# EAGLE schematic ESP32- 3.5 TFT Display(SPI)V1.0_20230116 (EAGLE 9.6.2)
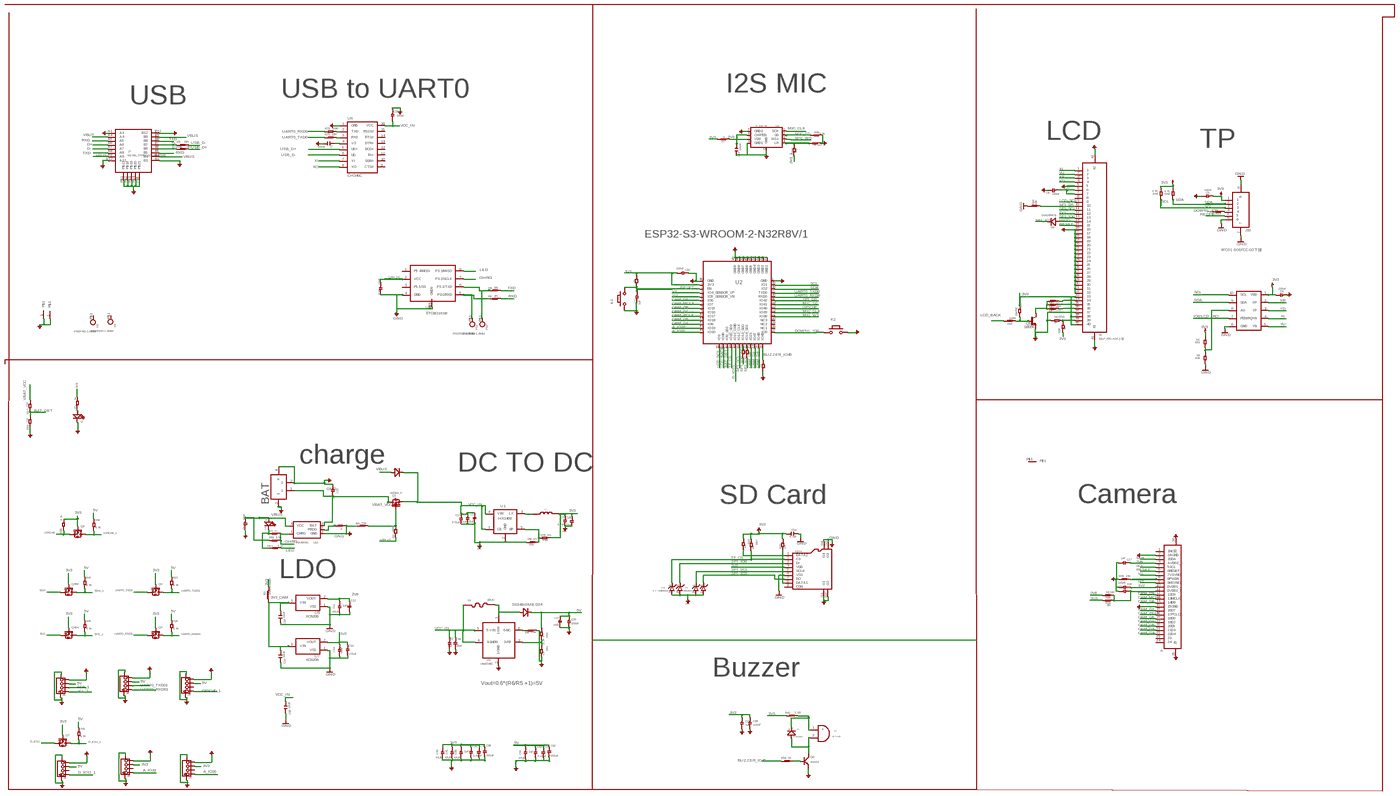
[diagram p0: schematic, sheet 1, overview]
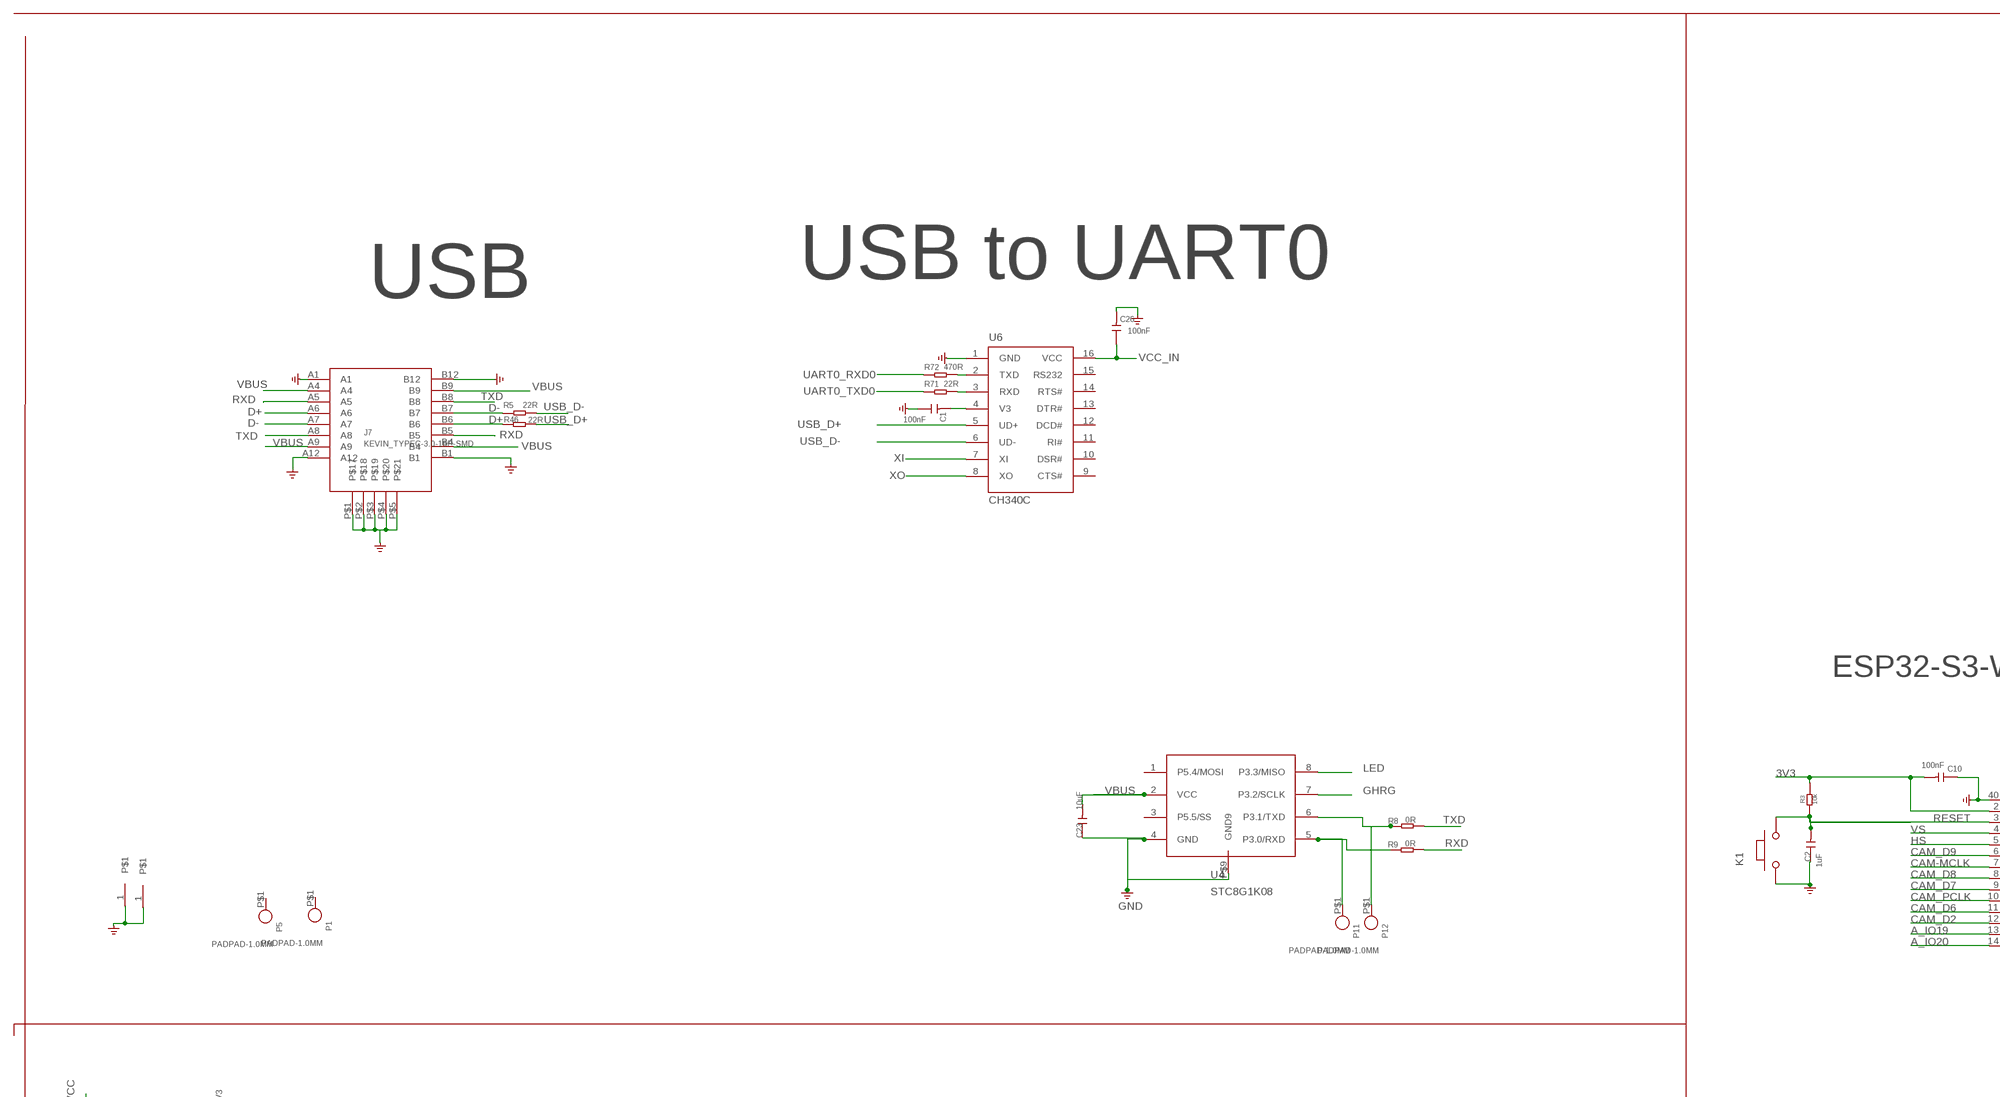
[diagram p1: schematic, sheet 1, part 1 of 4]
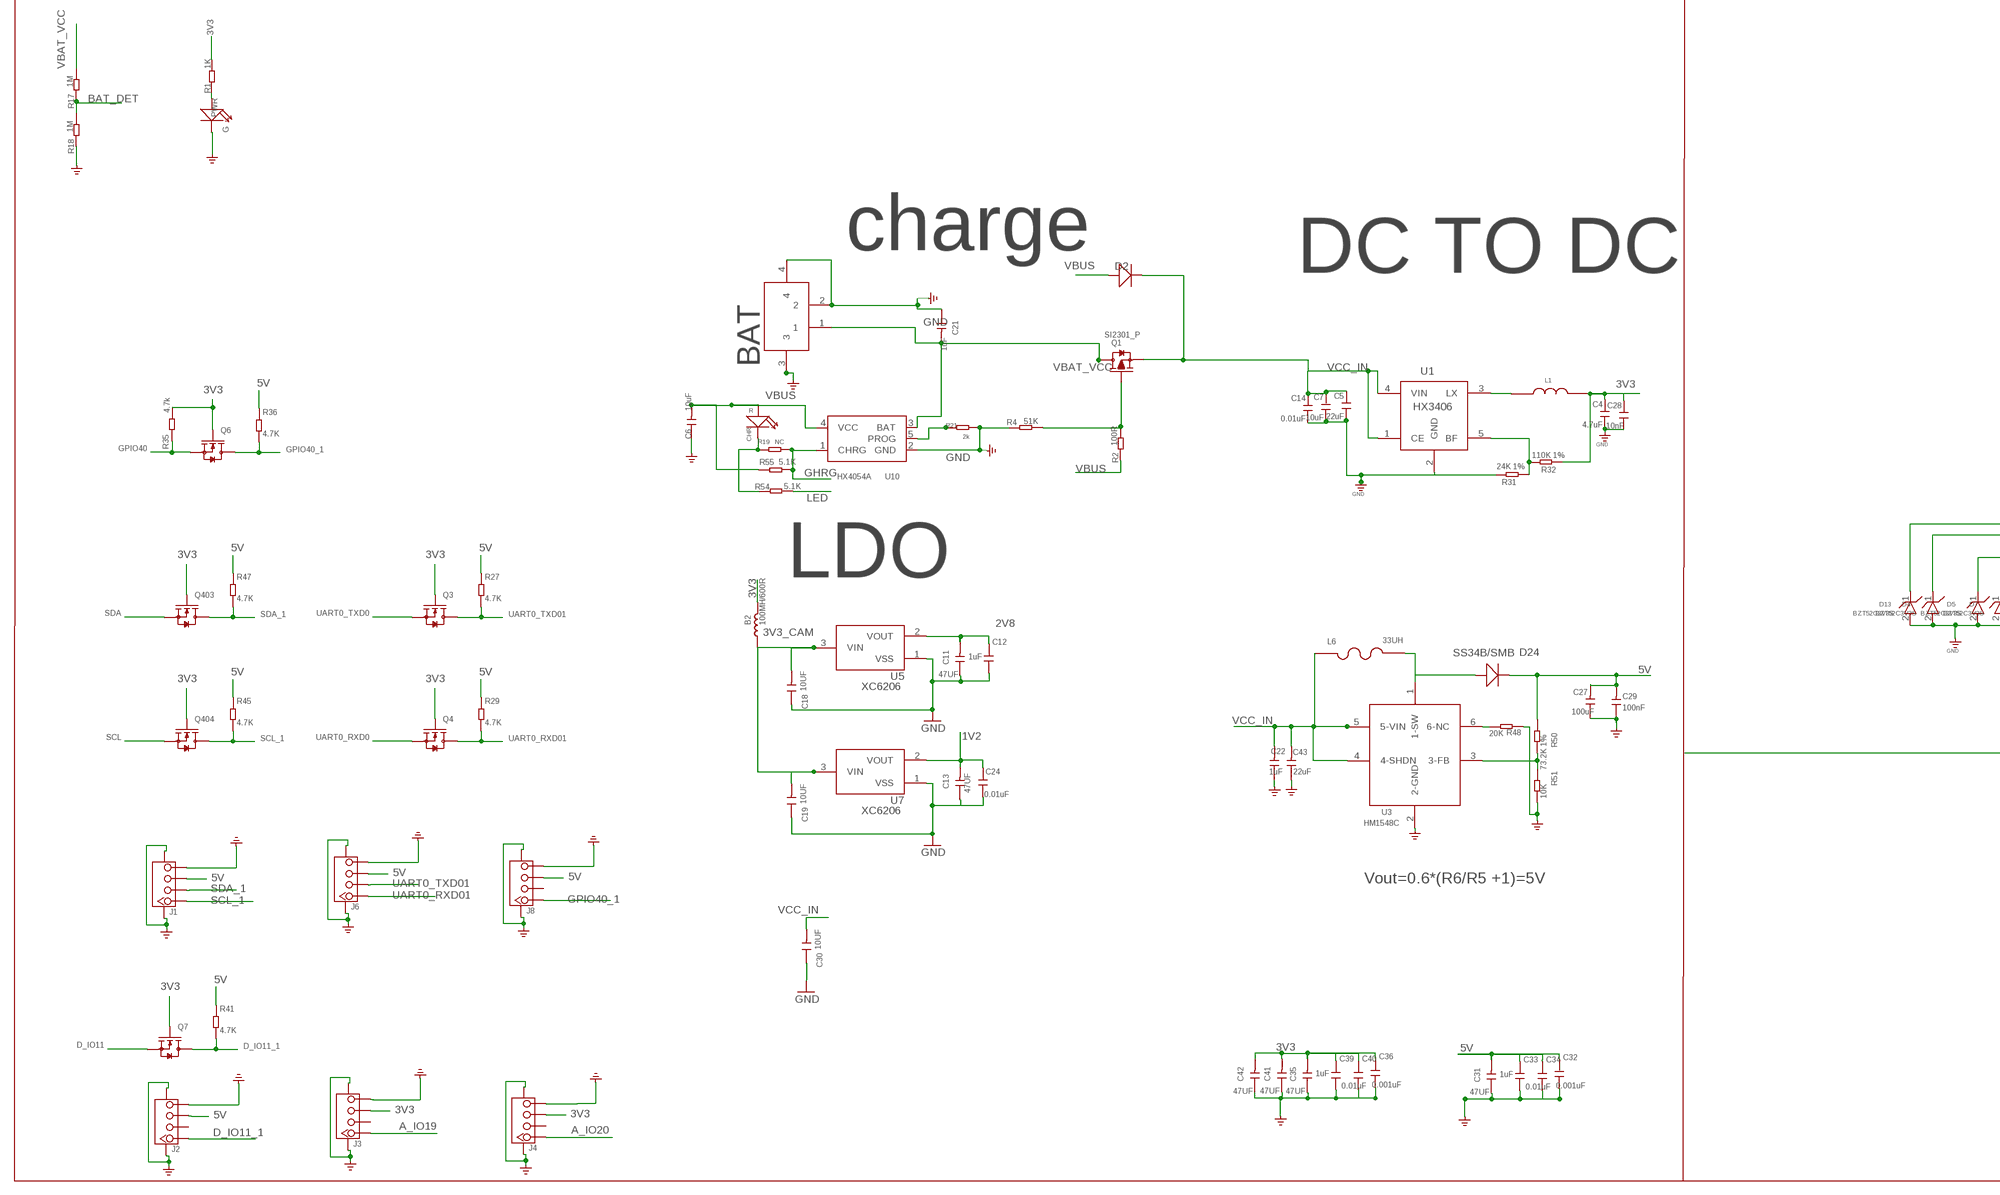
[diagram p2: schematic, sheet 1, part 2 of 4]
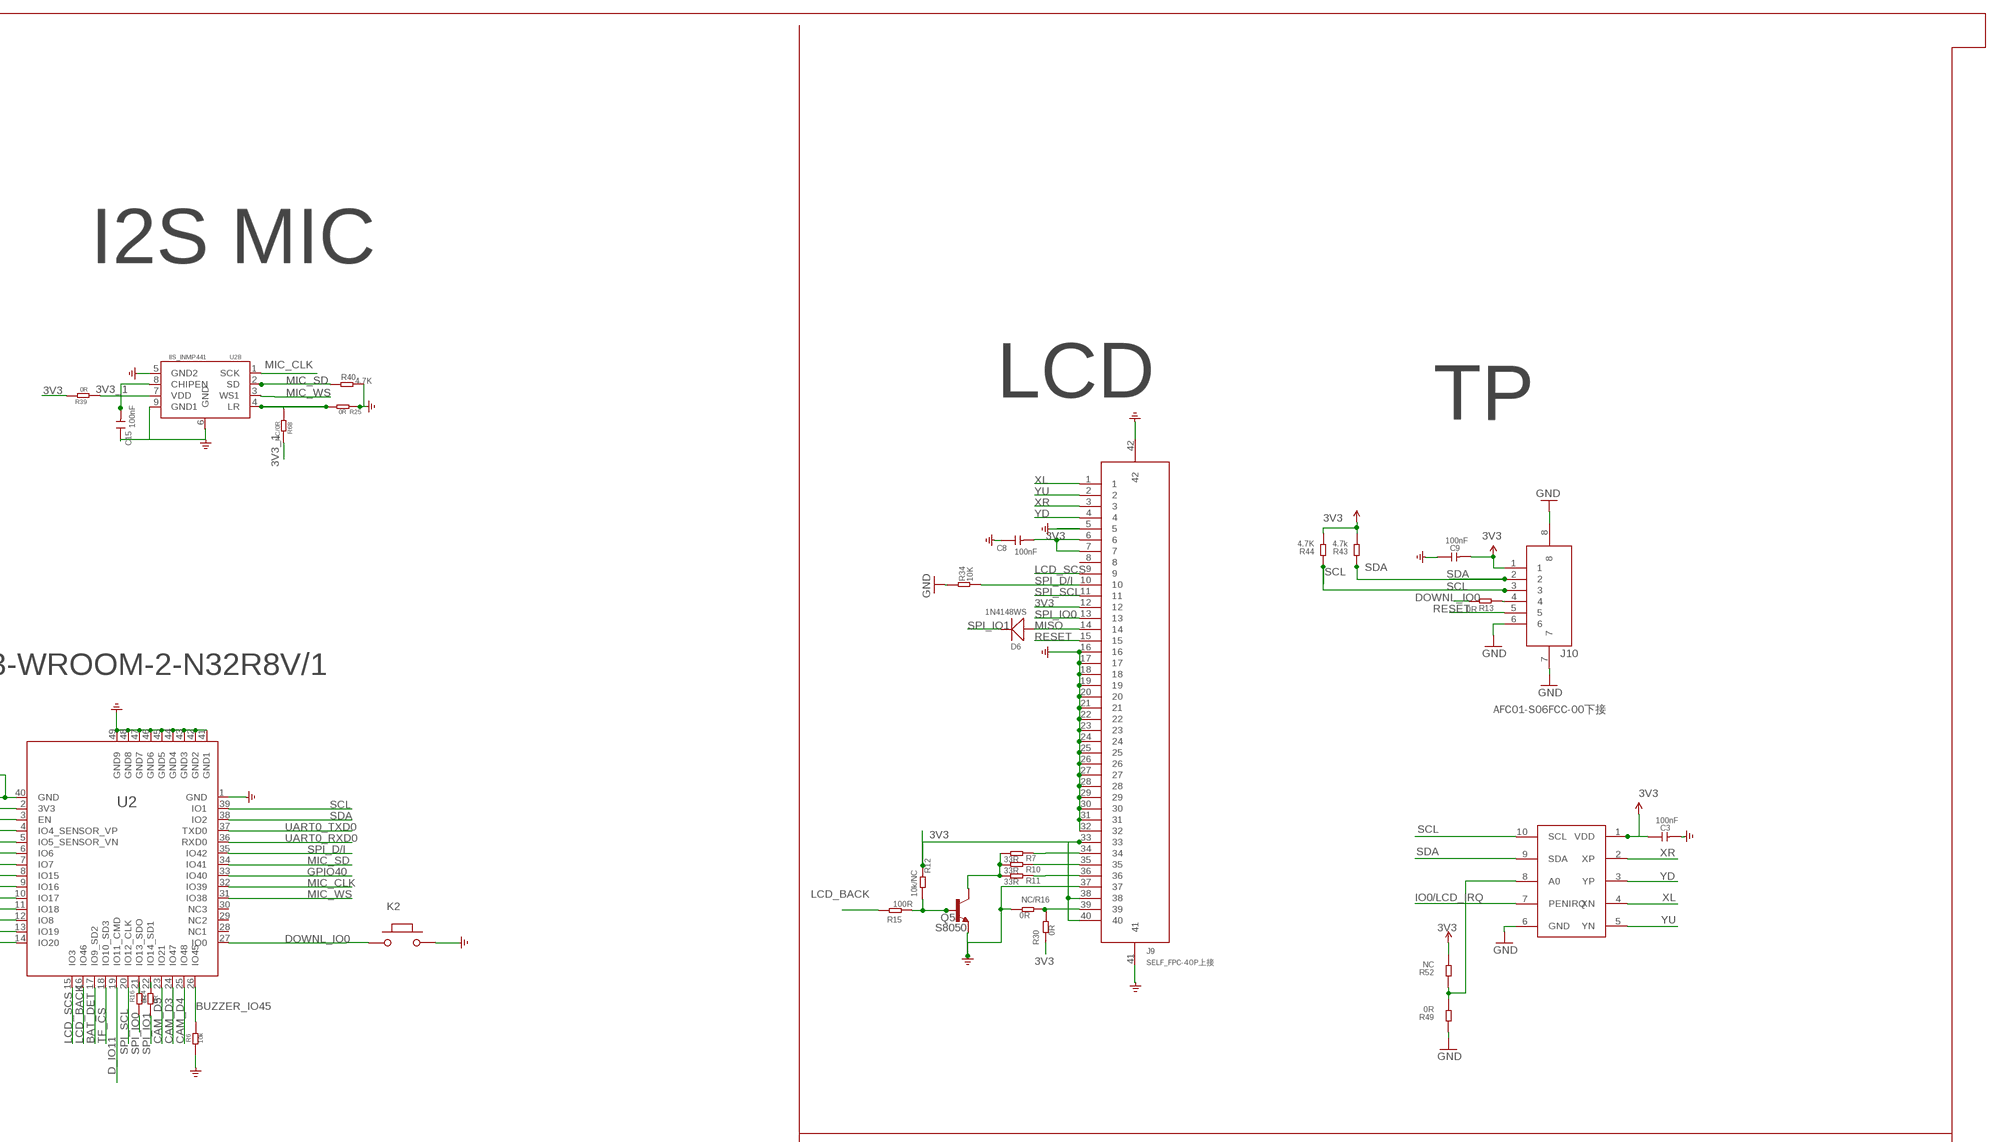
[diagram p3: schematic, sheet 1, part 3 of 4]
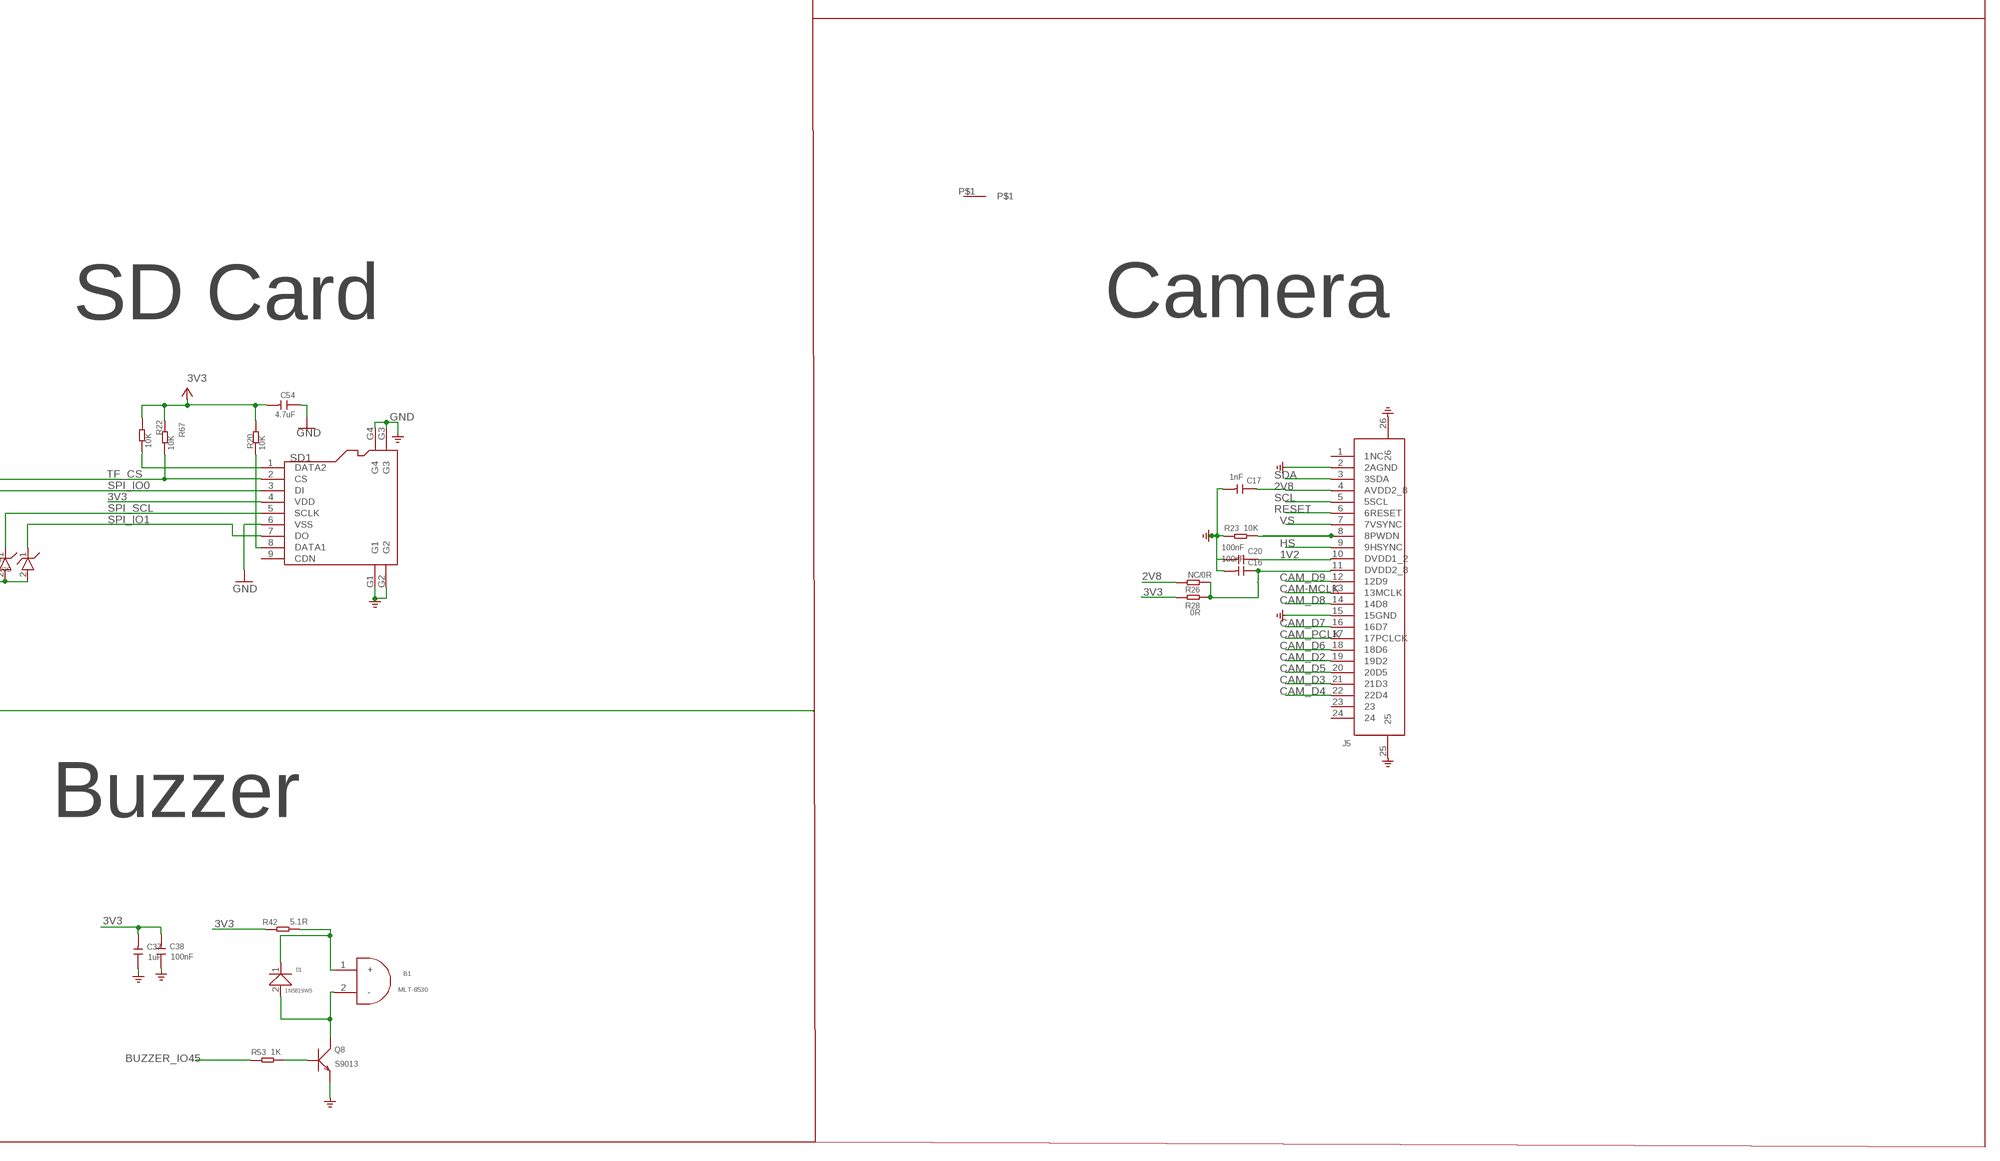
[diagram p4: schematic, sheet 1, part 4 of 4]

## Parts
B1  MLT-8530  [MLT-8530]
B2  100MH/600R  L0805  [0805@1]
BAT  CON-80-2P-M  [2P-2.0-M]
C1  100nF  C0603  [0603]
C2  1uF  C-0603  [C0603]
C3  100nF  C-0603  [C0603]
C4  4.7uF  C0603  [0603]
C5  22uF  C0603  [0603]
C6  10uF  C-0603  [C0603]
C7  10uF  C0603  [0603]
C8  100nF  C-0603  [C0603]
C9  100nF  C-0603  [C0603]
C10  100nF  C-0603  [C0603]
C11  47UF  C1206  [1206]
C12  1uF  C0603  [0603]
C13  47UF  C1206  [1206]
C14  0.01uF  C0603  [0603]
C15  100nF  C-0603  [C0603]
C16  100nF  C-0603  [C0603]
C17  1nF  C-0603  [C0603]
C18  10UF  C-0603  [C0603]
C19  10UF  C-0603  [C0603]
C20  100nF  C-0603  [C0603]
C21  1uF  C-0603  [C0603]
C22  1uF  C0603  [0603]
C23  10uF  C-0603  [C0603]
C24  0.01uF  C0603  [0603]
C26  100nF  C0603  [0603]
C27  100uF  C0805  [0805]
C28  10nF  C0603  [0603]
C29  100nF  C0603  [0603]
C30  10UF  C-0603  [C0603]
C31  47UF  C1206  [1206]
C32  0.001uF  C0603  [0603]
C33  1uF  C0603  [0603]
C34  0.01uF  C0603  [0603]
C35  47UF  C1206  [1206]
C36  0.001uF  C0603  [0603]
C37  1uF  DISCRETE_C-0603  [DISCRETE_C0603]
C38  100nF  DISCRETE_C-0603  [DISCRETE_C0603]
C39  1uF  C0603  [0603]
C40  0.01uF  C0603  [0603]
C41  47UF  C1206  [1206]
C42  47UF  C1206  [1206]
C43  22uF  C0805  [0805]
C54  4.7uF  DISCRETE_C-0603  [DISCRETE_C0603]
CHR  R  007-LED0603  [D0603]
D1  1N5819WS  [SOD-323]
D2  1N5819/S0D-123  D'1N4148-SMD'  [1206-1]
D4  BZT52C3V3S  [SOD-323@1]
D5  BZT52C3V3S  [SOD-323@1]
D6  1N4148WS  D'0805'  [SOD323]
D7  BZT52C3V3S  [SOD-323@1]
D13  BZT52C3V3S  [SOD-323@1]
D24  SS34B/SMB  214ABDO-214AB  [214AB]
J1  TWIG-4P-2.0-SMD-FEMALE-REINFORCE'90D'  [4P-SMD-2.0-90D]
J2  TWIG-4P-2.0-SMD-FEMALE-REINFORCE'90D'  [4P-SMD-2.0-90D]
J3  TWIG-4P-2.0-SMD-FEMALE-REINFORCE'90D'  [4P-SMD-2.0-90D]
J4  TWIG-4P-2.0-SMD-FEMALE-REINFORCE'90D'  [4P-SMD-2.0-90D]
J5  SMD_HEADERP_24PX0.5上接  SMD_HEADERP_24PX0.5  [SMD_HEADERP_24PX0.5]
J6  TWIG-4P-2.0-SMD-FEMALE-REINFORCE'90D'  [4P-SMD-2.0-90D]
J7  KEVIN_TYPEC-3.0-16P-SMD  [KEVIN_3.0TYPEC-SMD]
J8  TWIG-4P-2.0-SMD-FEMALE-REINFORCE'90D'  [4P-SMD-2.0-90D]
J9  SELF_FPC-40P上接  SELF_FPC-40P  [SELF_SMD42-50P-2560L490W]
J10  AFC01-S06FCC-00下接  AFC01-S06FCC-00  [SMD8-50P-740L535W]
K1  BUTTON  PB157  [157SW]
K2  BUTTON  PB157  [157SW]
L1  CD32_10uH  CD32_950MA  [CD32]
L6  33UH  L-773  [L773]
NC/R16  0R  R0603  [R0603]
P1  PADPAD-1.0MM  [PAD-1.0MM]
P3  3M-5  [3M-5]
P4  3M-5  [3M-5]
P5  PADPAD-1.0MM  [PAD-1.0MM]
P11  PADPAD-1.0MM  [PAD-1.0MM]
P12  PADPAD-1.0MM  [PAD-1.0MM]
PWR  G  LED'0603'  [LED-0603]
Q1  SI2301_P  DISCRETE_MOSFET-PSOT23  [DISCRETE_SOT23]
Q3  MOSFET-N'SOT23'  [SOT23]
Q4  MOSFET-N'SOT23'  [SOT23]
Q5  S8050  SPARKFUN_TRANSISTOR_NPNSOT23  [SPARKFUN_SOT23]
Q6  MOSFET-N'SOT23'  [SOT23]
Q7  MOSFET-N'SOT23'  [SOT23]
Q8  S9013  TRANSISTOR-NPN-SOT23  [SOT23@1]
Q403  MOSFET-N'SOT23'  [SOT23]
Q404  MOSFET-N'SOT23'  [SOT23]
R1  1K  R-0603  [R0603]
R2  100R  R0603  [R0603]
R3  10k  R-0603  [R0603]
R4  51K  R0603  [R0603]
R5  22R  DISCRETE_R-0603  [DISCRETE_R0603]
R6  10k  R-0603  [R0603]
R7  33R  R0603  [R0603]
R8  0R  R0603  [R0603]
R9  0R  R0603  [R0603]
R10  33R  R0603  [R0603]
R11  33R  R0603  [R0603]
R12  10k/NC  R0603  [R0603]
R13  0R  DISCRETE_R-0603  [DISCRETE_R0603]
R15  100R  R0603  [R0603]
R16  0R  R-0603  [R0603]
R17  1M  R0603  [R0603]
R18  1M  R0603  [R0603]
R19  NC  R-0603  [R0603]
R20  10K  DISCRETE_R-0603  [DISCRETE_R0603]
R21  2k  R-0603  [R0603]
R22  10K  DISCRETE_R-0603  [DISCRETE_R0603]
R23  10K  DISCRETE_R-0603  [DISCRETE_R0603]
R24  0R  R-0603  [R0603]
R25  0R  R-0603  [R0603]
R26  NC/0R  R0603  [R0603]
R27  4.7K  R0603  [R0603]
R28  0R  R0603  [R0603]
R29  4.7K  R0603  [R0603]
R30  0R  R0603  [R0603]
R31  24K 1%  R0603  [R0603]
R32  110K 1%  R0603  [R0603]
R34  10K  DISCRETE_R-0603  [DISCRETE_R0603]
R35  4.7k  R0603  [R0603]
R36  4.7K  R0603  [R0603]
R39  0R  R-0603  [R0603]
R40  4.7K  DISCRETE_R-0603  [DISCRETE_R0603]
R41  4.7K  R0603  [R0603]
R42  5.1R  R0603  [R0603]
R43  4.7k  DISCRETE_R-0603  [DISCRETE_R0603]
R44  4.7K  DISCRETE_R-0603  [DISCRETE_R0603]
R45  4.7K  R0603  [R0603]
R46  22R  DISCRETE_R-0603  [DISCRETE_R0603]
R47  4.7K  R0603  [R0603]
R48  20K  DISCRETE_R-0603  [DISCRETE_R0603]
R49  0R  DISCRETE_R-0603  [DISCRETE_R0603]
R50  73.2K 1%  DISCRETE_R-0603  [DISCRETE_R0603]
R51  10K  DISCRETE_R-0603  [DISCRETE_R0603]
R52  NC  DISCRETE_R-0603  [DISCRETE_R0603]
R53  1K  DISCRETE_R-0603  [DISCRETE_R0603]
R54  5.1K  DISCRETE_R-0603  [DISCRETE_R0603]
R55  5.1K  DISCRETE_R-0603  [DISCRETE_R0603]
R67  10K  DISCRETE_R-0603  [DISCRETE_R0603]
R68  NC/0R  R-0603  [R0603]
R71  22R  DISCRETE_R-0603  [DISCRETE_R0603]
R72  470R  DISCRETE_R-0603  [DISCRETE_R0603]
SD1  HOLDER-MICROSD-9P  [9P-SMD-W/-RING]
U1  HX3406  [SOT23-5]
U2  ESP32-S3-WROOM-2-N32R8V/1  [ESP32-S3-WROOM-2-N32R8V/1]
U3  HM1548C  HM1548/SOT23-6  [A_XBJ_SOT23-6]
U4  STC8G1K08  [DFN8]
U5  XC6206  [SOT-23]
U6  CH340C  CH340G  [SOP-16]
U7  XC6206  [SOT-23]
U8  NS2009  [MSOP10]
U10  HX4054A  [HX4054A_SOT23_5]
U28  IIS_INMP441  [IIS_INMP441]
U$63  TFT-3.5  [LCD3.5寸]

## Nets
1V2: C13.2 C20.1 C24.1 J5.10(DVDD1_2) U7.2(VOUT)
2V8: C11.2 C12.1 C17.1 J5.4(AVDD2_8) R26.2 U5.2(VOUT)
3V3: B2.2 C3.1 C4.1 C8.2 C9.2 C10.2 C28.1 C35.2 C36.1 C37.2 C38.2 C39.1 C40.1 C41.2 C42.2 C54.2 J3.3 J4.3 J9.6 J9.7 J9.12 J9.33 J9.38 J9.40 J10.1 L1.2 Q3.1(G) Q4.1(G) Q6.1(G) Q7.1(G) Q403.1(G) Q404.1(G) R1.2 R3.2 R12.2 R20.1 R22.1 R28.2 R30.1 R32.2 R35.2 R39.2 R42.1 R43.2 R44.2 R52.2 R67.1 SD1.4(VDD) U2.2(3V3) U8.1(VDD) ; supply symbol labelled +3V3, 3.3V
3V3_1: C15.2 R39.1 R68.2 U28.7(VDD) U28.8(CHIPEN)
3V3_CAM: B2.1 C18.2 C19.2 U5.3(VIN) U7.3(VIN)
5V: C27.2 C29.2 C31.2 C32.1 C33.1 C34.1 D24.2(-) J1.3 J2.3 J6.3 J8.3 R27.1 R29.1 R36.1 R41.1 R45.1 R47.1 R50.1
A_IO19: J3.1 U2.13(IO19)
A_IO20: J4.1 U2.14(IO20)
BAT_DET: R17.2 R18.1 U2.17(IO9_SD2)
BUZZER_IO45: R6.2 R53.1 U2.26(IO45)
CAM-MCLK: J5.13(13MCLK) U2.7(IO7)
CAM_D2: J5.19(19D2) U2.12(IO8)
CAM_D3: J5.21(21D3) U2.24(IO47)
CAM_D4: J5.22(22D4) U2.25(IO48)
CAM_D5: J5.20(20D5) U2.23(IO21)
CAM_D6: J5.18(18D6) U2.11(IO18)
CAM_D7: J5.16(16D7) U2.9(IO16)
CAM_D8: J5.14(14D8) U2.8(IO15)
CAM_D9: J5.12(12D9) U2.6(IO6)
CAM_PCLK: J5.17(17PCLCK) U2.10(IO17)
D+: J7.A6 J7.B6 R46.1
D-: J7.A7 J7.B7 R5.1
D_IO11: Q7.2(S) U2.19(IO11_CMD)
D_IO11_1: J2.1 Q7.3(D) R41.2
DOWNL_IO0: K2.1 R13.2 U2.27(IO0)
GHRG: R19.2 R55.2 U4.7(P3.2/SCLK) U10.1(CHRG)
GND: BAT.2 BAT.3 BAT.4 C1.1 C2.1 C3.2 C4.2 C5.2 C6.1 C7.2 C8.1 C9.1 C10.1 C11.1 C12.2 C13.1 C14.2 C15.1 C16.2 C17.2 C18.1 C19.1 C20.2 C21.1 C22.1 C23.1 C24.2 C26.2 C27.1 C28.2 C29.1 C30.1 C31.1 C32.2 C33.2 C34.2 C35.1 C36.2 C37.1 C38.1 C39.2 C40.2 C41.1 C42.1 C43.1 C54.1 D4.2 D5.2 D7.2 D13.2 J1.4 J1.SS1 J1.SS2 J2.4 J2.SS1 J2.SS2 J3.4 J3.SS1 J3.SS2 J4.4 J4.SS1 J4.SS2 J5.2(2AGND) J5.15(15GND) J5.25 J5.26 J6.4 J6.SS1 J6.SS2 J7.A1 J7.A12 J7.B1 J7.B12 J7.P$1 J7.P$2 J7.P$3 J7.P$4 J7.P$5 J8.4 J8.SS1 J8.SS2 J9.5 J9.16 J9.17 J9.18 J9.19 J9.20 J9.21 J9.22 J9.23 J9.24 J9.25 J9.26 J9.27 J9.28 J9.29 J9.30 J9.31 J9.32 J9.37 J9.41 J9.42 J10.6 J10.7 J10.8 K1.1 K2.2 NC/R16.1 P3.1 P4.1 PWR.- Q5.2(E) Q8.2(E) R4.2 R6.1 R18.2 R21.2 R23.1 R25.2 R31.1 R34.1 R40.2 R48.1 R49.1 R51.2 SD1.6(VSS) SD1.G1 SD1.G2 SD1.G3 SD1.G4 U1.2(GND) U2.1(GND) U2.40(GND) U2.41(GND1) U2.42(GND2) U2.43(GND3) U2.44(GND4) U2.45(GND5) U2.46(GND6) U2.47(GND7) U2.48(GND8) U2.49(GND9) U3.2(2-GND) U4.4(GND) U4.P$9(GND9) U5.1(VSS) U6.1(GND) U7.1(VSS) U8.6(GND) U10.2(GND) U28.5(GND2) U28.6(GND) U28.9(GND1)
GPIO40: Q6.2(S) R35.1 U2.33(IO40)
GPIO40_1: J8.1 Q6.3(D) R36.2
HS: J5.9(9HSYNC) U2.5(IO5_SENSOR_VN)
IO0/LCD_IRQ: U8.7(PENIRQ)
LCD_BACK: R15.2 U2.16(IO46)
LCD_SCS: J9.9 U2.15(IO3)
LED: R54.2 U4.8(P3.3/MISO)
MIC_CLK: U2.32(IO39) U28.1(SCK)
MIC_SD: R40.1 U2.34(IO41) U28.2(SD)
MIC_WS: U2.31(IO38) U28.3(WS1)
MISO: D6.+ J9.14
N$1: C1.2 U6.4(V3)
N$2: PWR.+ R1.1
N$3: CHR.- R19.1 R54.1
N$4: Q1.1(G) R2.1 R4.1
N$5: P12.P$1 R8.2 U4.6(P3.1/TXD)
N$6: P11.P$1 R9.2 U4.5(P3.0/RXD)
N$7: D24.1(+) L6.2 U3.1(1-SW)
N$8: J9.34 R7.2
N$9: L1.1 U1.3(LX)
N$10: J9.35 R10.2
N$11: C16.1 J5.11(DVDD2_8) R26.1 R28.1
N$12: J9.36 R11.2
N$13: Q5.3(C) R7.1 R10.1 R11.1
N$14: Q5.1(B) R12.1 R15.1
N$15: J9.39 NC/R16.2 R30.2
N$16: R24.2 U2.22(IO14_SD1)
N$18: R16.2 U2.21(IO13_SDO)
N$19: R25.1 R68.1 U28.4(LR)
N$21: J10.4 R13.1
N$22: R31.2 R32.1 U1.5(BF)
N$24: R48.2 U3.6(6-NC)
N$25: J5.8(8PWDN) R23.2
N$26: R49.2 R52.1 U8.8(A0)
N$27: B1.2(-) D1.2(+) Q8.3(C)
N$29: B1.1(+) D1.1(-) R42.2
N$30: R50.2 R51.1 U3.3(3-FB)
N$31: R21.1 U10.5(PROG)
N$33: Q8.1(B) R53.2
N$40: R72.2 U6.2(TXD)
N$42: R71.2 U6.3(RXD)
N$47: R22.2 SD1.1(DATA2)
N$48: R20.2 SD1.8(DATA1)
RESET: C2.2 J5.6(6RESET) J9.15 J10.5 K1.2 R3.1 U2.3(EN)
RXD: J7.A5 J7.B5 R9.1
SCL: J5.5(5SCL) J10.3 Q404.2(S) R44.1 U2.39(IO1) U8.10(SCL)
SCL_1: J1.1 Q404.3(D) R45.2
SDA: J5.3(3SDA) J10.2 Q403.2(S) R43.1 U2.38(IO2) U8.9(SDA)
SDA_1: J1.2 Q403.3(D) R47.2
SPI_D/I: J9.10 R34.2 U2.35(IO42)
SPI_IO0: D4.1 J9.13 R16.1 SD1.3(DI)
SPI_IO1: D6.- D7.1 R24.1 SD1.7(DO)
SPI_SCL: D5.1 J9.11 SD1.5(SCLK) U2.20(IO12_CLK)
TF_CS: D13.1 R67.2 SD1.2(CS) U2.18(IO10_SD3)
TXD: J7.A8 J7.B8 R8.1
UART0_RXD0: Q4.2(S) R72.1 U2.36(RXD0)
UART0_RXD01: J6.1 Q4.3(D) R29.2
UART0_TXD0: Q3.2(S) R71.1 U2.37(TXD0)
UART0_TXD01: J6.2 Q3.3(D) R27.2
USB_D+: R46.2 U6.5(UD+)
USB_D-: R5.2 U6.6(UD-)
VBAT_VCC: BAT.1 C21.2 Q1.3(D) R17.1 U10.3(BAT)
VBUS: C6.2 C23.2 CHR.+ D2.A(+) J7.A4 J7.A9 J7.B4 J7.B9 R2.2 R55.1 U4.2(VCC) U10.4(VCC)
VCC_IN: C5.1 C7.1 C14.1 C22.2 C26.1 C30.2 C43.2 D2.C(-) L6.1 Q1.2(S) U1.1(CE) U1.4(VIN) U3.4(4-SHDN) U3.5(5-VIN) U6.16(VCC)
VS: J5.7(7VSYNC) U2.4(IO4_SENSOR_VP)
XI: U6.7(XI)
XL: J9.1 U8.4(XN)
XO: U6.8(XO)
XR: J9.3 U8.2(XP)
YD: J9.4 U8.3(YP)
YU: J9.2 U8.5(YN)
Unconnected: J2.2 J3.2 J4.2 J5.1(1NC) J5.23 J5.24 J8.2 J9.8 P1.P$1 P5.P$1 SD1.9(CDN) U2.28(NC1) U2.29(NC2) U2.30(NC3) U4.1(P5.4/MOSI) U4.3(P5.5/SS) U6.9(CTS#) U6.10(DSR#) U6.11(RI#) U6.12(DCD#) U6.13(DTR#) U6.14(RTS#) U6.15(RS232) U$63.P$1

## Notes on the sheet
- USB to UART0 | I2S MIC
- USB
- LCD | TP
- charge
- DC TO DC
- BAT | SD Card | Camera
- LDO
- Buzzer
- Vout=0.6*(R6/R5 +1)=5V

## Library data of the parts
B1 = A_xbj:MLT-8530
B2 = Discrete:L*
BAT = DW1000:CON-80-2P-M
C1 C22 C26 C29 = A_xbj:C0603
C2 C3 C6 C8-C10 C15-C21 C23 C30 = Discrete:C*: Ceramic Capacitors
C4 C5 C7 C12 C14 C24 C28 C32-C34 C36 C39 C40 = cooper:C0603
C11 C13 C31 C35 C41 C42 = A_xbj:C1206
C27 C43 = A_xbj:C0805
C37 C38 = A_xbj:DISCRETE_C*: Ceramic Capacitors
C54 = A9G:DISCRETE_C*: Ceramic Capacitors
CHR = Discrete:007-LED*
D1 = A_xbj:1N5819WS
D2 D6 = Discrete:D*
D4 D5 D7 D13 = A_xbj:BZT52C3V3S
D24 = DO-214AB:214AB: 214AB
J1-J4 J6 J8 = Connector:TWIG-4P-2.0-SMD-FEMALE-REINFORCE
J5 = HEADER:SMD_HEADERP_24PX0.5
J7 = untitled:KEVIN_TYPEC-3.0-16P-SMD
J9 = 0.5_FPC-40P:SELF_FPC-40P
J10 = self:AFC01-S06FCC-00
K1 K2 = MySMD:PB157
L1 = CD54:CD32_950MA
L6 = crowpi_pow:L-773
NC/R16 R2 R4 R7-R12 R15 R17 R18 R26-R32 R35 R36 R41 R45 R47 = cooper:R0603
P1 P5 P11 P12 = crowpi_pow:PAD*
P3 P4 = DW1000:3M-5
PWR = Discrete:LED*
Q1 = untitled:DISCRETE_MOSFET-P: IRLL014: http://www.vishay.com/docs/91319/sihll014.pdf
Q3 Q4 Q6 Q7 Q403 Q404 = Discrete:MOSFET-N: IRLL014: http://www.vishay.com/docs/91319/sihll014.pdf
Q5 = Adafruit_HUZZAH32_ESP32_Feather:SPARKFUN_TRANSISTOR_NPN: Transistor NPN BJT configuration in SOT23 package. MMBT2222 is the common NPN we use. Double check BCE configuration again layout.
Q8 = discrete:TRANSISTOR-NPN*: NPN audion
R1 R3 R6 R16 R19 R21 R24 R25 R39 R68 = Discrete:R*
R5 R20 R22 R23 R40 R46 R48 R50 R51 R53-R55 R67 R71 R72 = Crowtail-_LED-V2.0-20190615-01:DISCRETE_R*
R13 R34 R43 R44 R49 R52 = A9G:DISCRETE_R*
R42 = A_xbj:R0603
SD1 = Connector:HOLDER-MICROSD-9P
U1 = DFN8:HX3406
U2 = ESP32-S3-WROOM-2-N32R8V1:ESP32-S3-WROOM-2-N32R8V/1
U3 = CrowBOT-V1.0-20220530库:HM1548/SOT23-6
U4 = DFN8:STC8G1K08
U5 U7 = self:XC6206
U6 = A_xbj:CH340G
U8 = NS2009:NS2009
U10 = ESP32-S3-WROOM-2-N32R8V1:HX4054A
U28 = ICS_43432:IIS_INMP441
U$63 = DW1000:TFT-3.5

## Net classes
0 default: width 0.152 mm, drill 0.152 mm, clearance 0.152 mm